# EAGLE design rgbMatrix (EAGLE 7.5.0)

## Sheet 1 of 4: CONTROLLER
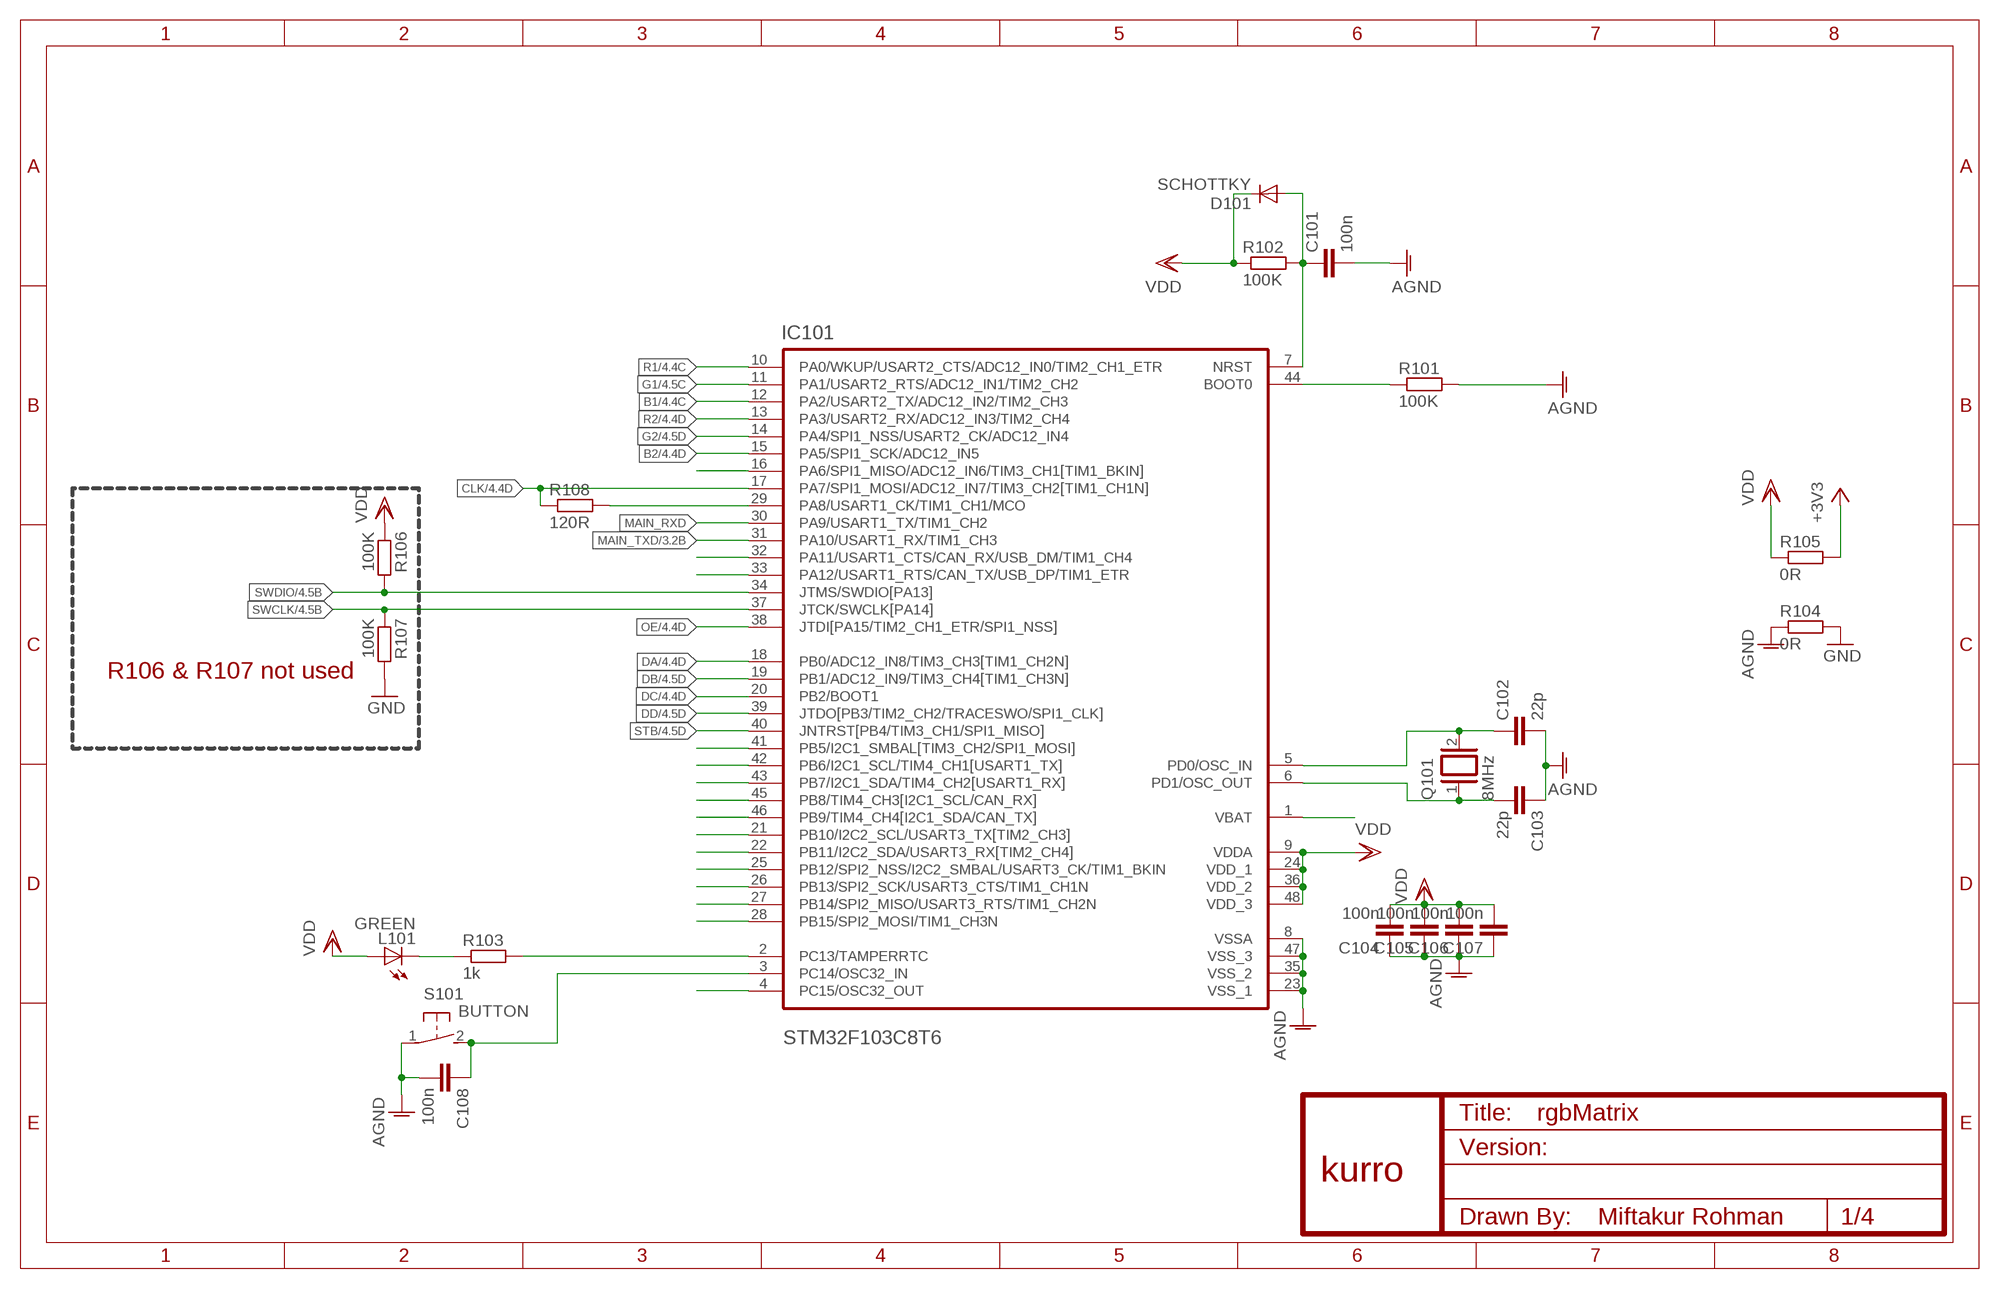
[diagram p0: schematic, sheet 1]

### Parts
C101  100n  C-EUC0603  [C0603]
C102  22p  C-EUC0603  [C0603]
C103  22p  C-EUC0603  [C0603]
C104  100n  C-EUC0603  [C0603]
C105  100n  C-EUC0603  [C0603]
C106  100n  C-EUC0603  [C0603]
C107  100n  C-EUC0603  [C0603]
C108  100n  C-EUC0603  [C0603]
D101  SCHOTTKY  DIODE-MICROMELF-W  [MICROMELF-W]
IC101  STM32F103C8T6  [QFP50P900X900X160-48N]
L101  GREEN  LED3MM  [LED3MM]
Q101  8MHz  XTAL/S  [QS]
R101  100K  R-EU_R0603  [R0603]
R102  100K  R-EU_R0603  [R0603]
R103  1k  R-EU_R0603  [R0603]
R104  0R  R-EU_R0603  [R0603]
R105  0R  R-EU_R0603  [R0603]
R106  100K  R-EU_R0603  [R0603]
R107  100K  R-EU_R0603  [R0603]
R108  120R  R-EU_R0603  [R0603]
S101  BUTTON  01-XX2  [B3F-01XXX]
U$1  KURRO_FOOTPRINT  [KURRO-LOGO]

### Nets
+3V3: R105.2 ; also sheet 2,3,4
AGND [ic]: C101.2 C102.2 C103.1 C104.1 C105.1 C106.1 C107.1 C108.2 IC101.8(VSSA) IC101.23(VSS_1) IC101.35(VSS_2) IC101.47(VSS_3) R101.2 R104.1 S101.1(P)
B1 [ic]: IC101.12(PA2/USART2_TX/ADC12_IN2/TIM2_CH3) ; also sheet 4
B2 [ic]: IC101.15(PA5/SPI1_SCK/ADC12_IN5) ; also sheet 4
BOOT0 [ic]: IC101.44(BOOT0) R101.1
CLK [ic]: IC101.17(PA7/SPI1_MOSI/ADC12_IN7/TIM3_CH2[TIM1_CH1N]) R108.1 ; also sheet 4
DA [ic]: IC101.18(PB0/ADC12_IN8/TIM3_CH3[TIM1_CH2N]) ; also sheet 4
DB [ic]: IC101.19(PB1/ADC12_IN9/TIM3_CH4[TIM1_CH3N]) ; also sheet 4
DC [ic]: IC101.20(PB2/BOOT1) ; also sheet 4
DD [ic]: IC101.39(JTDO[PB3/TIM2_CH2/TRACESWO/SPI1_CLK]) ; also sheet 4
G1 [ic]: IC101.11(PA1/USART2_RTS/ADC12_IN1/TIM2_CH2) ; also sheet 4
G2 [ic]: IC101.14(PA4/SPI1_NSS/USART2_CK/ADC12_IN4) ; also sheet 4
GND: R104.2 R107.2 ; also sheet 2,3,4
LED1_BUILTIN [ic]: IC101.2(PC13/TAMPERRTC) R103.2
MAIN_RXD [ic]: IC101.30(PA9/USART1_TX/TIM1_CH2)
MAIN_TXD [ic]: IC101.31(PA10/USART1_RX/TIM1_CH3) ; also sheet 3
N$1 [ic]: IC101.29(PA8/USART1_CK/TIM1_CH1/MCO) R108.2
N$2 [ic]: IC101.45(PB8/TIM4_CH3[I2C1_SCL/CAN_RX])
N$6 [ic]: C103.2 IC101.6(PD1/OSC_OUT) Q101.1
N$7 [ic]: C102.1 IC101.5(PD0/OSC_IN) Q101.2
N$8 [ic]: IC101.46(PB9/TIM4_CH4[I2C1_SDA/CAN_TX])
N$9 [ic]: L101.K(C) R103.1
N$11 [ic]: C108.1 IC101.3(PC14/OSC32_IN) S101.2(S)
N$13 [ic]: IC101.42(PB6/I2C1_SCL/TIM4_CH1[USART1_TX])
N$14 [ic]: IC101.43(PB7/I2C1_SDA/TIM4_CH2[USART1_RX])
N$15 [ic]: IC101.21(PB10/I2C2_SCL/USART3_TX[TIM2_CH3])
N$16 [ic]: IC101.22(PB11/I2C2_SDA/USART3_RX[TIM2_CH4])
N$24 [ic]: IC101.32(PA11/USART1_CTS/CAN_RX/USB_DM/TIM1_CH4)
N$27 [ic]: IC101.25(PB12/SPI2_NSS/I2C2_SMBAL/USART3_CK/TIM1_BKIN)
N$28 [ic]: IC101.26(PB13/SPI2_SCK/USART3_CTS/TIM1_CH1N)
N$29 [ic]: IC101.27(PB14/SPI2_MISO/USART3_RTS/TIM1_CH2N)
N$30 [ic]: IC101.28(PB15/SPI2_MOSI/TIM1_CH3N)
N$42 [ic]: IC101.16(PA6/SPI1_MISO/ADC12_IN6/TIM3_CH1[TIM1_BKIN])
N$46 [ic]: IC101.33(PA12/USART1_RTS/CAN_TX/USB_DP/TIM1_ETR)
N$51 [ic]: IC101.41(PB5/I2C1_SMBAL[TIM3_CH2/SPI1_MOSI])
N$57 [ic]: IC101.4(PC15/OSC32_OUT)
N$58 [ic]: IC101.1(VBAT)
OE [ic]: IC101.38(JTDI[PA15/TIM2_CH1_ETR/SPI1_NSS]) ; also sheet 4
R1 [ic]: IC101.10(PA0/WKUP/USART2_CTS/ADC12_IN0/TIM2_CH1_ETR) ; also sheet 4
R2 [ic]: IC101.13(PA3/USART2_RX/ADC12_IN3/TIM2_CH4) ; also sheet 4
RST [ic]: C101.1 D101.A IC101.7(NRST) R102.2
STB [ic]: IC101.40(JNTRST[PB4/TIM3_CH1/SPI1_MISO]) ; also sheet 4
SWCLK [ic]: IC101.37(JTCK/SWCLK[PA14]) R107.1 ; also sheet 4
SWDIO [ic]: IC101.34(JTMS/SWDIO[PA13]) R106.2 ; also sheet 4
VDD [ic]: C104.2 C105.2 C106.2 C107.2 D101.C IC101.9(VDDA) IC101.24(VDD_1) IC101.36(VDD_2) IC101.48(VDD_3) L101.A R102.1 R105.1 R106.1

### Notes on the sheet
- R106 & R107 not used

## Sheet 2 of 4: POWER
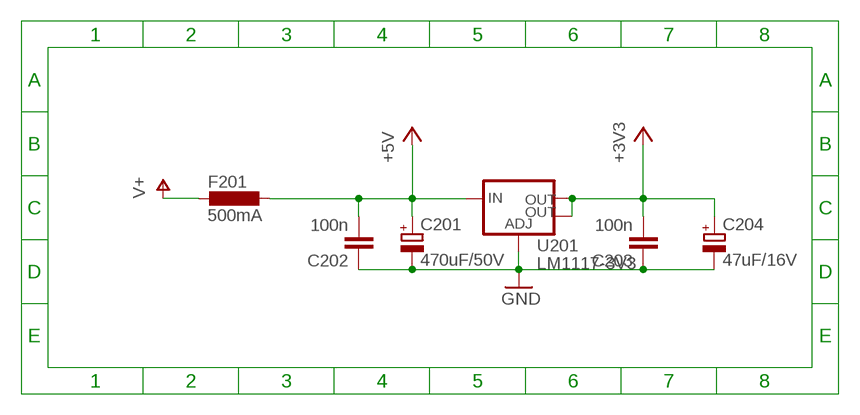
[diagram p1: schematic, sheet 2]

### Parts
C201  470uF/50V  CPOL-EUE5-10.5  [E5-10,5]
C202  100n  C-EUC0603  [C0603]
C203  100n  C-EUC0603  [C0603]
C204  47uF/16V  CPOL-EUE2-5  [E2-5]
F201  500mA  L-EUL1812  [L1812]
U201  LM1117-3V3  V_REG_LM1117SOT223  [SOT223]

### Nets
+3V3: C203.2 C204.+ U201.2(OUT) U201.4(OUT) ; also sheet 1,3,4
+5V: C201.+ C202.2 F201.1 U201.3(IN)
GND: C201.- C202.1 C203.1 C204.- U201.1(ADJ) ; also sheet 1,3,4
V+: F201.2 ; also sheet 4

## Sheet 3 of 4: COMM
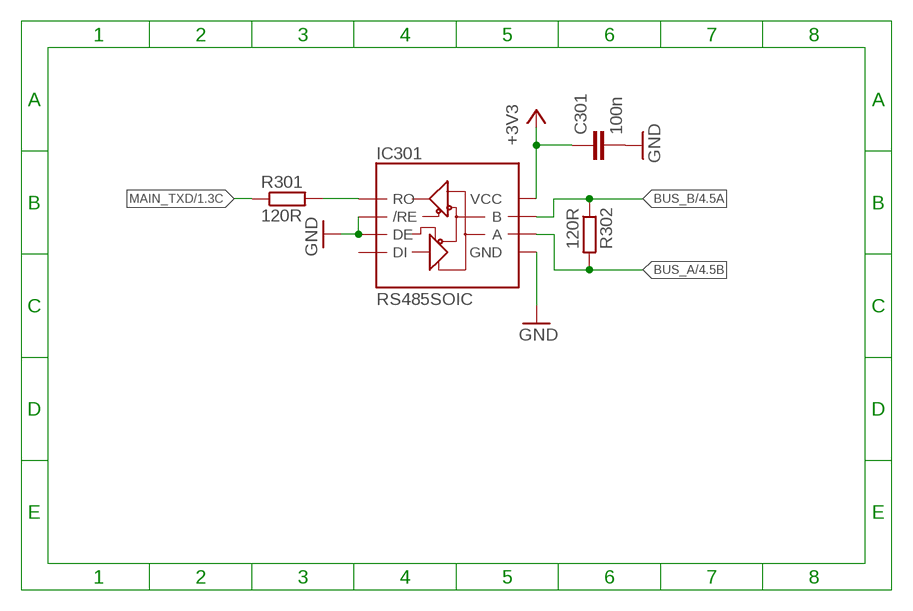
[diagram p2: schematic, sheet 3]

### Parts
C301  100n  C-EUC0603  [C0603]
IC301  RS485SOIC  [SO08]
R301  120R  R-EU_R0603  [R0603]
R302  120R  R-EU_R0603  [R0603]

### Nets
+3V3: C301.1 IC301.8(VCC) ; also sheet 1,2,4
BUS_A: IC301.6(A) R302.2 ; also sheet 4
BUS_B: IC301.7(B) R302.1 ; also sheet 4
GND: C301.2 IC301.2(/RE) IC301.3(DE) IC301.5(GND) ; also sheet 1,2,4
MAIN_TXD [ic]: R301.1 ; also sheet 1
N$10: IC301.1(RO) R301.2
Unconnected: IC301.4(DI)

## Sheet 4 of 4: CONNECTOR
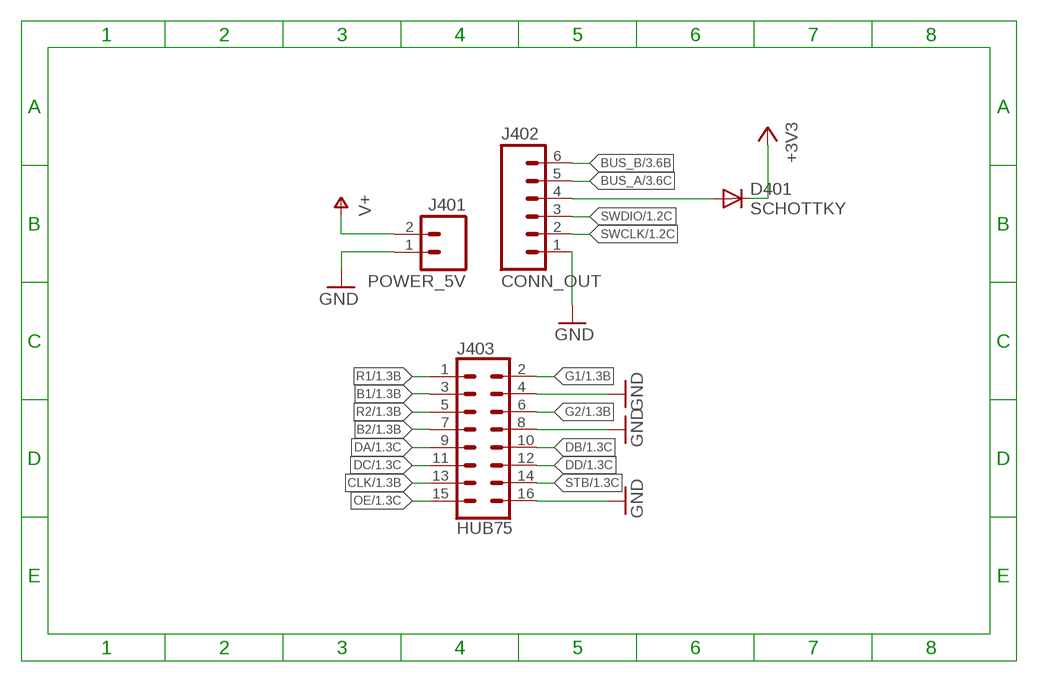
[diagram p3: schematic, sheet 4]

### Parts
D401  SCHOTTKY  DIODE-MICROMELF-W  [MICROMELF-W]
J401  POWER_5V  M02-XH-RA  [XH-2-RA]
J402  CONN_OUT  M06-XH-RA  [XH-6-RA]
J403  HUB75  PINHEAD-2X8  [2X08-LOCK]

### Nets
+3V3: D401.C ; also sheet 1,2,3
B1 [ic]: J403.3 ; also sheet 1
B2 [ic]: J403.7 ; also sheet 1
BUS_A: J402.5 ; also sheet 3
BUS_B: J402.6 ; also sheet 3
CLK [ic]: J403.13 ; also sheet 1
DA [ic]: J403.9 ; also sheet 1
DB [ic]: J403.10 ; also sheet 1
DC [ic]: J403.11 ; also sheet 1
DD [ic]: J403.12 ; also sheet 1
G1 [ic]: J403.2 ; also sheet 1
G2 [ic]: J403.6 ; also sheet 1
GND: J401.1 J402.1 J403.4 J403.8 J403.16 ; also sheet 1,2,3
N$3: D401.A J402.4
OE [ic]: J403.15 ; also sheet 1
R1 [ic]: J403.1 ; also sheet 1
R2 [ic]: J403.5 ; also sheet 1
STB [ic]: J403.14 ; also sheet 1
SWCLK [ic]: J402.2 ; also sheet 1
SWDIO [ic]: J402.3 ; also sheet 1
V+: J401.2 ; also sheet 2

## Library data of the parts
C101-C108 C202 C203 C301 = resistor:C-EU: CAPACITOR, European symbol
C201 C204 = rcl:CPOL-EU: POLARIZED CAPACITOR, European symbol
D101 D401 = diode:DIODE-: DIODE
F201 = rcl:L-EU: INDUCTOR, European symbol
IC101 = ST Microelctronics_By_element14_Batch_1:STM32F103C8T6: Medium-density performance line ARM-based 32-bit MCU; LINK: https://www.tokopedia.com/embedded-world/stm32-stm32f103c8t6-lqfp48-arm-based-microcontroller-mcu-lqfp-48-au02; MPN: STM32F103CBT6; OC_FARNELL: 1606327; OC_NEWARK: 11N8296; PACKAGE: QFP-48; SUPPLIER: STMICROELECTRONICS
IC301 = SparkFun-DigitalIC:RS485: RS485 transceiver
J401 = SparkFun-Connectors:M02: Standard 2-pin 0.1" header. Use with - straight break away headers ( PRT-00116) - right angle break away headers (PRT-00553) - swiss pins (PRT-00743) - machine pins (PRT-00117) - female headers (PRT-00115) Molex polarized connector foot print use with: PRT-08233 with associated crimp pins and housings. 2.54_SCREWTERM for use with PRT-10571. 3.5mm Screw Terminal footprints for PRT-08084 5mm Screw Terminal footprints for use with PRT-08433
J402 = SparkFun-Connectors:M06: Header 6 Standard 6-pin 0.1" header. Use with straight break away headers (SKU : PRT-00116), right angle break away headers (PRT-00553), swiss pins (PRT-00743), machine pins (PRT-00117), and female headers (PRT-00115). Molex polarized connector foot print use with SKU : PRT-08094 with associated crimp pins and housings. NOTES ON THE VARIANTS LOCK and LOCK_LONGPADS... This footprint was designed to help hold the alignment of a through-hole component (i.e. 6-pin header) while soldering it into place. You may notice that each hole has been shifted either up or down by 0.005 of an inch from it's more standard position (which is a perfectly straight line). This slight alteration caused the pins (the squares in the middle) to touch the edges of the holes. Because they are alternating, it causes a "brace" to hold the component in place. 0.005 has proven to be the perfect amount of "off-center" position when using our standard breakaway headers. Although looks a little odd when you look at the bare footprint, once you have a header in there, the alteration is very hard to notice. Also,if you push a header all the way into place, it is covered up entirely on the bottom side. This idea of altering the position of holes to aid alignment will be further integrated into the Sparkfun Library for other footprints. It can help hold any component with 3 or more connection pins.
J403 = edes_lib_160827:PINHEAD-2X8
L101 = SparkFun:LED: LEDs Standard schematic elements and footprints for 5mm, 3mm, 1206, and 0603 sized LEDs. 5mm - Spark Fun Electronics SKU : COM-00529 (and others)
Q101 = special:XTAL/S: CRYSTAL
R101-R103 R106-R108 R301 R302 = resistor:R-EU_: RESISTOR, European symbol
R104 R105 = resistor:R-EU_: RESISTOR, European symbol; LINK: https://www.tokopedia.com/iotelkafi/resistor-smd-0603-0r
S101 = switch-omron:01-XX
U201 = SparkFun-IC-Power:V_REG_LM1117: Voltage Regulator LM1117 Standard adjustable voltage regulator but in SMD form. Spark Fun Electronics SKU : COM-00595; PROD_ID: VREG-08170
U$1 = SparkFun:KURRO_FOOTPRINT

## Net classes
0 default: width 0.406 mm, drill 0.59 mm, clearance 0.305 mm
1 ic: width 0.254 mm, drill 0.59 mm, clearance 0.203 mm

## Board
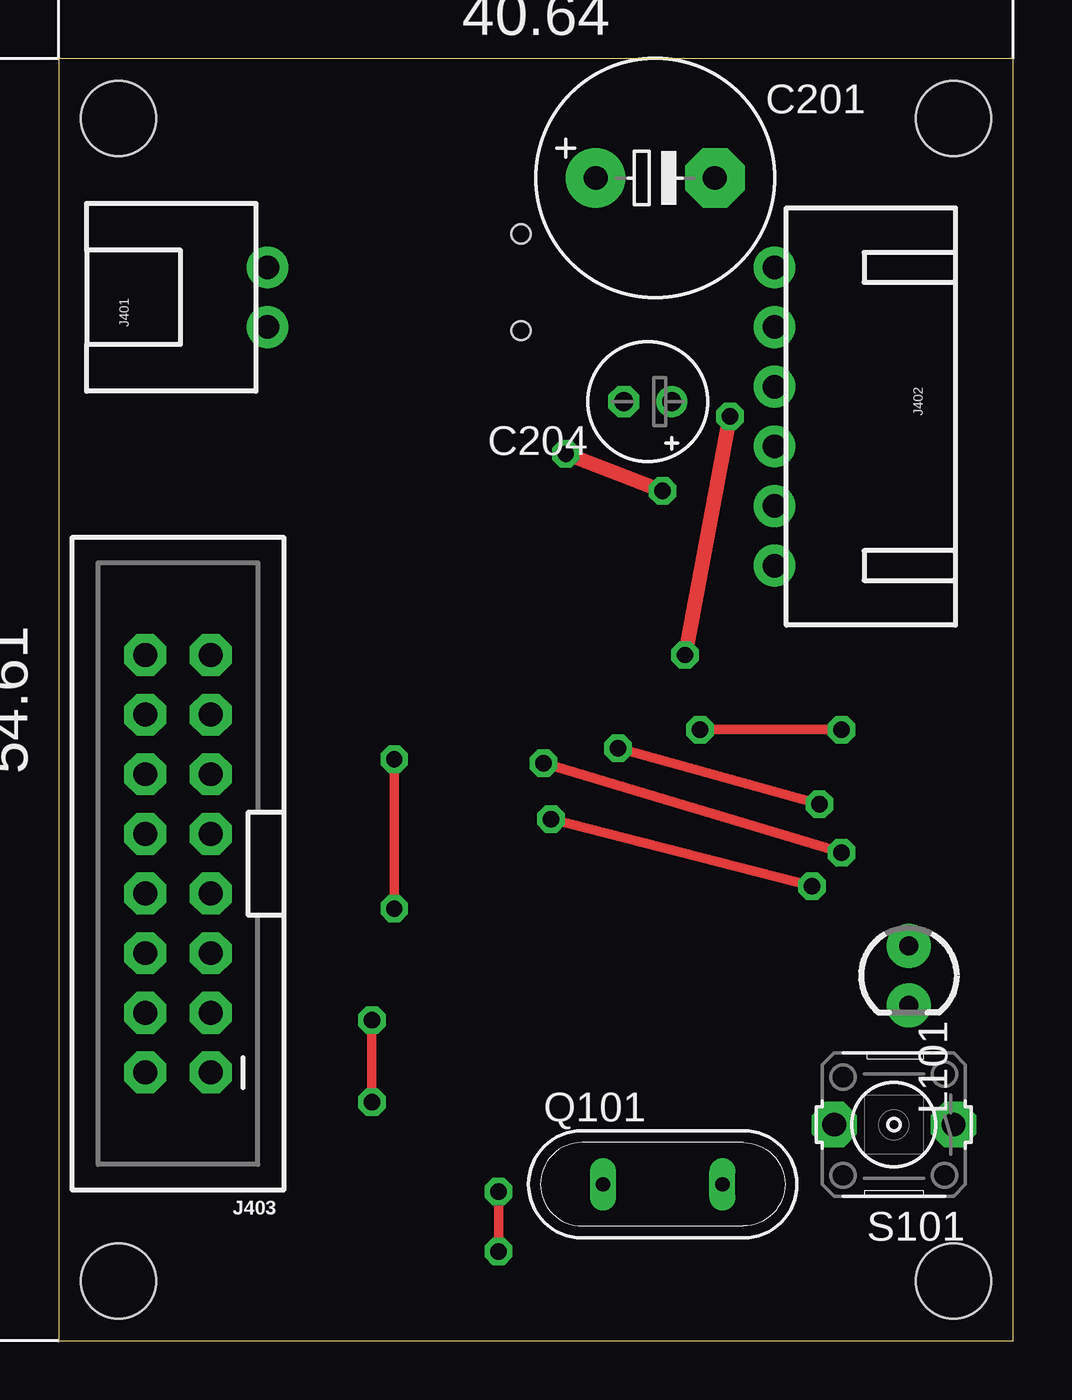
[diagram p4: board, top side]
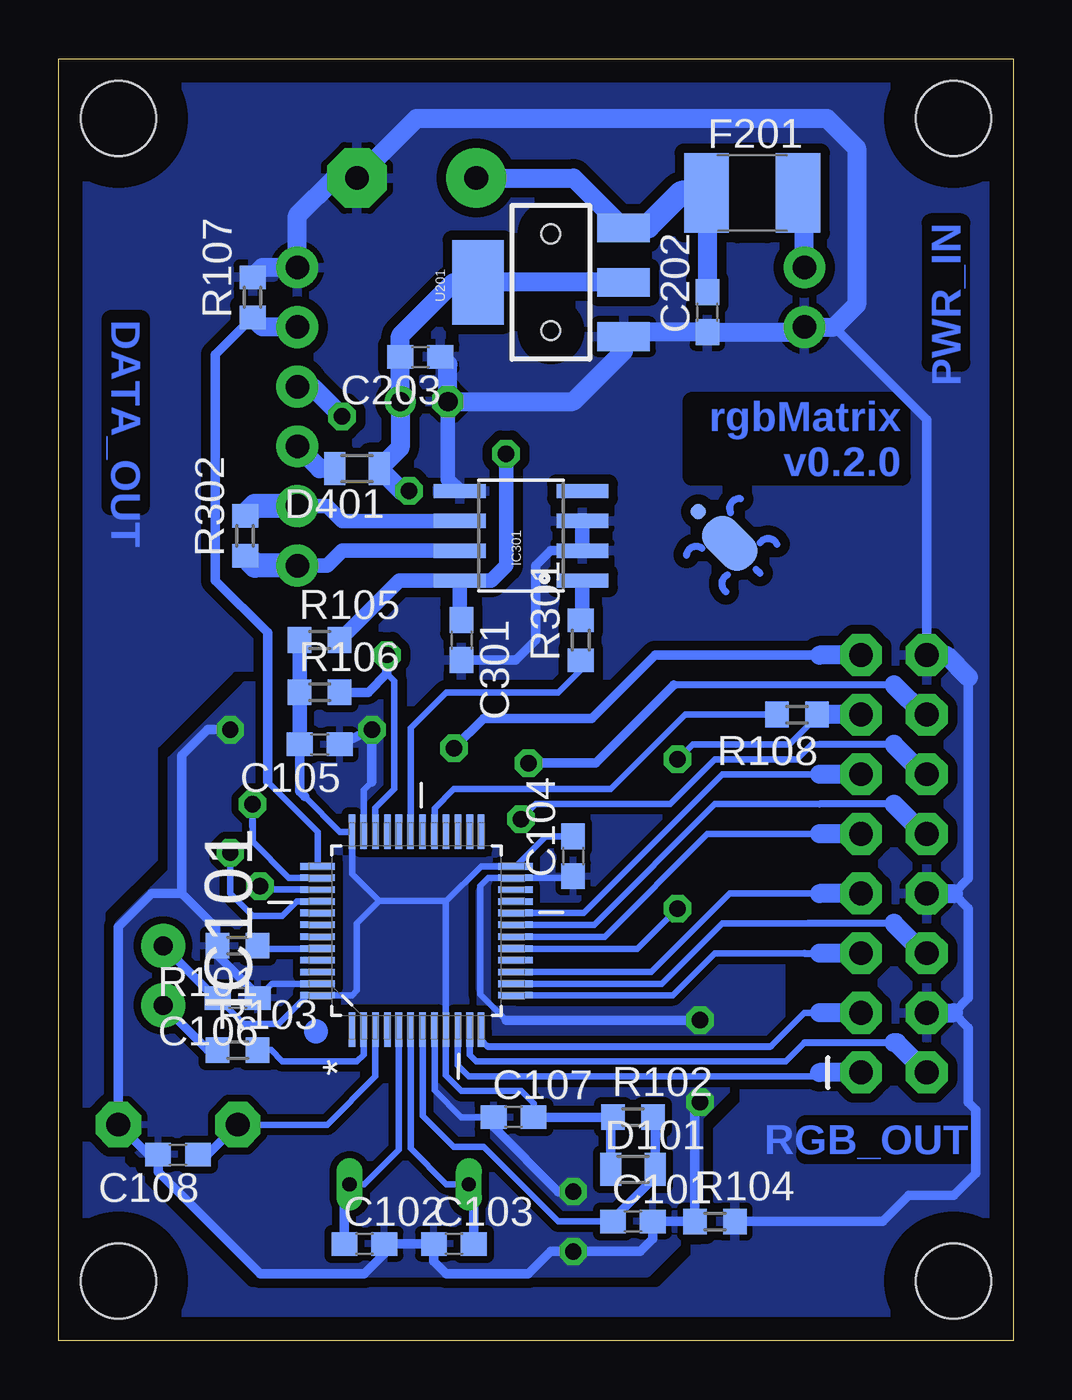
[diagram p5: board, bottom side, seen from below]

Size 40.64 x 54.61 mm. Coordinates in mm from the lower left corner, seen from the top.
Outline: 0,0 40.64,0 40.64,54.61 0,54.61 0,0
Copper layers (1*16): Top 0.035mm / dielectric 1.5mm / Bottom 0.035mm
Design rules "default *": minimum track width 10mil, minimum drill 24mil, track to track 8mil, track to pad 8mil, pad to pad 8mil, via to via 8mil, smd to smd 8mil, copper to edge 40mil, drill to drill 8mil, minimum pad ring 10mil, minimum via ring 8mil, stop-mask expansion 4mil, vias tented up to drill 0mil, thermal gap 10mil
Holes 3.2 mm at 2.54,2.54 38.1,2.54 38.1,52.07 2.54,52.07
Holes 0.8 mm at 19.68,43.02 19.68,47.15
bRestrict: area 0,0 to 5.1,5.1; area 35.6,0 to 40.6,5.1; area 35.6,49.5 to 40.6,54.6; area 0,49.5 to 5.1,54.6; area 10.5,47.1 to 11.7,50.6

### Footprints (pad centres in the part's own frame; a part is rotated, then mirrored left to right if it is on the bottom)
C0603 = smd 1.1 x 1: 1 -0.85,0; 2 0.85,0
E5-10,5 = drill 1.016 pad 2.54: + -2.54,0 | drill 1.016 pad 2.54 octagon: - 2.54,0
E2-5 = drill 0.813 pad 1.27: + -1.016,0 | drill 0.813 pad 1.27 octagon: - 1.016,0
MICROMELF-W = smd 0.9 x 1.4: A 0.95,0; C -0.95,0
L1812 = smd 1.9 x 3.4: 1 -1.95,0; 2 1.95,0
QFP50P900X900X160-48N = smd 1.473 x 0.279: 1 -4.216,2.743; 2 -4.216,2.261; 3 -4.216,1.753; 4 -4.216,1.245; 5 -4.216,0.762; 6 -4.216,0.254; 7 -4.216,-0.254; 8 -4.216,-0.762; 9 -4.216,-1.245; 10 -4.216,-1.753; 11 -4.216,-2.261; 12 -4.216,-2.743; 25 4.216,-2.743; 26 4.216,-2.261; 27 4.216,-1.753; 28 4.216,-1.245; 29 4.216,-0.762; 30 4.216,-0.254; 31 4.216,0.254; 32 4.216,0.762; 33 4.216,1.245; 34 4.216,1.753; 35 4.216,2.261; 36 4.216,2.743 | smd 0.279 x 1.473: 13 -2.743,-4.216; 14 -2.261,-4.216; 15 -1.753,-4.216; 16 -1.245,-4.216; 17 -0.762,-4.216; 18 -0.254,-4.216; 19 0.254,-4.216; 20 0.762,-4.216; 21 1.245,-4.216; 22 1.753,-4.216; 23 2.261,-4.216; 24 2.743,-4.216; 37 2.743,4.216; 38 2.261,4.216; 39 1.753,4.216; 40 1.245,4.216; 41 0.762,4.216; 42 0.254,4.216; 43 -0.254,4.216; 44 -0.762,4.216; 45 -1.245,4.216; 46 -1.753,4.216; 47 -2.261,4.216; 48 -2.743,4.216
SO08 = smd 0.61 x 2.21: 1 -1.905,-2.616; 2 -0.635,-2.616; 3 0.635,-2.616; 4 1.905,-2.616; 5 1.905,2.616; 6 0.635,2.616; 7 -0.635,2.616; 8 -1.905,2.616
XH-2-RA = drill 1 pad 1.778: 1 -1.27,0; 2 1.27,0
XH-6-RA = drill 1 pad 1.778: 1 -6.35,0; 2 -3.81,0; 3 -1.27,0; 4 1.27,0; 5 3.81,0; 6 6.35,0
2X08-LOCK = drill 1.016 pad 1.778 octagon: 1 -1.397,8.89; 2 1.397,8.89; 3 -1.397,6.35; 4 1.397,6.35; 5 -1.397,3.81; 6 1.397,3.81; 7 -1.397,1.27; 8 1.397,1.27; 9 -1.397,-1.27; 10 1.397,-1.27; 11 -1.397,-3.81; 12 1.397,-3.81; 13 -1.397,-6.35; 14 1.397,-6.35; 15 -1.397,-8.89; 16 1.397,-8.89
LED3MM = drill 0.813 pad 1.88: A -1.27,0; K 1.27,0
QS = drill 0.61 long: 1 -2.54,0; 2 2.54,0
R0603 = smd 1 x 1.1: 1 -0.85,0; 2 0.85,0
B3F-01XXX = drill 1.016 pad 1.93 octagon: 1 -2.54,0; 2 2.54,0
SOT223 = smd 1.219 x 2.235: 1 -2.311,-3.099; 2 0,-3.099; 3 2.311,-3.099 | smd 3.6 x 2.2: 4 0,3.099
KURRO-LOGO = smd 2.54 x 1.651 rotated 45 bottom: P$1 0,0 | smd 0.635 x 0.635 rotated 45 bottom: P$2 1.347,1.347

### Placement (x,y rotation side)
C101  16.19,5.08 0 bottom
C102  27.62,4.13 0 bottom
C103  23.81,4.13 0 bottom
C104  18.73,20.64 90 bottom
C105  29.53,25.4 180 bottom
C106  33.02,14.61 180 bottom
C107  21.27,9.53 0 bottom
C108  35.56,7.94 180 bottom
C201  25.4,49.53 0 top
C202  13.02,43.81 90 bottom
C203  25.24,41.91 180 bottom
C204  25.08,40.01 180 top
C301  23.5,29.84 270 bottom
D101  16.19,7.3 0 bottom
D401  27.94,37.15 180 bottom
F201  11.11,48.9 0 bottom
IC101  25.4,17.46 90 bottom
IC301  20.95,34.29 90 bottom
J401  8.89,44.45 90 top
J402  30.48,39.37 270 top
J403  5.08,20.32 180 top
L101  36.2,15.56 270 top
Q101  25.72,6.67 0 top
R101  33.02,16.83 180 bottom
R102  16.19,9.53 0 bottom
R103  33.02,12.38 0 bottom
R104  12.7,5.08 0 bottom
R105  29.53,29.84 0 bottom
R106  29.53,27.62 0 bottom
R107  32.38,44.45 90 bottom
R108  9.21,26.67 180 bottom
R301  18.41,29.84 90 bottom
R302  32.7,34.29 90 bottom
S101  35.56,9.21 180 top
U201  19.68,45.09 90 bottom
U$1  12.06,33.97 0 top

### Tracks (layer width: path | path; a pad name or v marks a point on that pad's centre or on a via)
+3V3  (via drill 0.7 pad 1.17)
  Top 0.61: v25.72,36.2 v21.59,37.78
  Bottom 0.61: IC301.8 23.57,30.77 C301.1 | v21.59,37.78 21.59,33.02 22.23,32.38 IC301.8 | IC301.8 26.14,32.38 R105.2
  Bottom 0.813: U201.2 U201.4 23.81,45.09 26.09,42.81 C203.2 C204.+ 26.1,38.04 D401.C 26.04,36.2 v25.72,36.2
+5V
  Bottom 0.813: F201.1 13.02,48.85 C202.2 | C201.+ 18.72,49.53 U201.3
  Bottom 1.016: F201.1 14.13,48.9 15.56,47.47 16.52,47.47 U201.3
AGND  (via drill 0.7 pad 1.17)
  Top 0.406: v18.73,6.35 v18.73,3.81 | v13.34,10.16 v13.34,13.65 | v27.3,26.04 v33.34,26.04
  Bottom 0.279: IC101.47 31.57,15.2 C106.1 | C104.1 18.8,19.72 IC101.23 22.35,19.72 22.7,19.37 22.7,14.76 21.59,13.65 | IC101.35 27.66,23.46 27.3,23.81 | IC101.8 24.64,10.67 23.5,9.53 C107.1
  Bottom 0.406: C106.1 32.17,14.71 33.87,16.41 R101.2 33.97,16.93 33.97,17.62 35.4,19.05 | C107.1 22.12,9.11 19.37,6.35 v18.73,6.35 | v13.34,13.65 21.59,13.65 | v13.34,10.16 13.55,9.95 R104.1 C101.2 15.34,4.34 15.88,3.81 v18.73,3.81 19.68,3.81 20.64,2.86 24.13,2.86 24.66,3.39 C103.1 C102.2 26.77,3.71 27.62,2.86 32.07,2.86 36.41,7.2 C108.2 36.83,7.94 S101.1 38.1,17.62 36.67,19.05 35.4,19.05 | 27.3,23.81 v27.3,26.04 C105.1 | v33.34,26.04 34.29,26.04 35.4,24.92 35.4,19.05
  Bottom 0.61: 28.57,25.3 C105.1
  pour Bottom (isolate 0.305, rank 5): 9.84,13.02 9.84,21.59 26.04,27.94 32.7,27.94 35.88,24.77 35.88,20 38.1,17.78 38.1,8.89 32.07,2.86 15.56,2.86 13.34,5.08 13.34,9.53
B1
  Bottom 0.279: IC101.12 22.66,12.81 22.38,12.54 | 10.32,12.54 8.89,13.97 8.26,13.97
  Bottom 0.305: 22.38,12.54 10.32,12.54
  Bottom 0.813: J403.3 8.26,13.97
B2
  Bottom 0.279: IC101.15 15.4,15.71 12.06,19.05 8.26,19.05
  Bottom 0.813: J403.7 8.26,19.05
BOOT0
  Bottom 0.279: IC101.44 32.04,16.7 R101.1
BUS_A
  Bottom 0.61: IC301.6 28.57,34.92 29.21,35.56 J402.5
  Bottom 1.016: J402.5 32.28,35.56 R302.2
BUS_B
  Bottom 0.61: IC301.7 28.57,33.66 29.21,33.02 J402.6
  Bottom 1.016: J402.6 32.28,33.02 R302.1
CLK  (via drill 0.7 pad 1.17)
  Top 0.406: v14.29,18.41 v14.29,24.77
  Bottom 0.279: IC101.17 16,16.7 v14.29,18.41 | R108.1 8.36,26.57 9.53,25.4 13.65,25.4 v14.29,24.77
  Bottom 0.813: J403.13 R108.1
DA
  Bottom 0.279: IC101.18 17.4,17.21 13.02,21.59 8.26,21.59
  Bottom 0.813: J403.9 8.26,21.59
DB
  Bottom 0.279: IC101.19 17.84,17.72 12.7,22.86 8.26,22.86
  Bottom 0.305: 5.08,22.86 8.26,22.86
  Bottom 0.813: J403.10 3.81,21.59 5.08,22.86
DC
  Bottom 0.279: IC101.20 18.29,18.22 12.38,24.13 8.26,24.13
  Bottom 0.813: J403.11 8.26,24.13
DD  (via drill 0.7 pad 1.17)
  Top 0.406: v20.95,22.23 v32.07,19.37
  Bottom 0.279: 8.26,25.4 8.57,25.4 9.21,24.77 12.7,24.77 14.61,22.86 20.32,22.86 v20.95,22.23 | IC101.39 31.91,19.21 v32.07,19.37
  Bottom 0.305: 5.08,25.4 8.26,25.4
  Bottom 0.813: J403.12 3.81,24.13 5.08,25.4
G1
  Bottom 0.279: IC101.11 23.14,12.19 22.86,11.91 9.68,11.91 8.89,12.7
  Bottom 0.305: 5.08,12.7 8.89,12.7
  Bottom 0.813: 5.08,12.7 4.95,12.7 J403.2
G2
  Bottom 0.279: IC101.14 14.96,15.2 12.38,17.78 8.73,17.78
  Bottom 0.305: 5.08,17.78 8.73,17.78
  Bottom 0.813: J403.6 3.81,16.51 5.08,17.78
GND
  Bottom 0.406: C301.2 21.17,29 20.32,29.84 20.32,33.02 19.68,33.66 IC301.2 | 1.91,28.26 1.91,19.68 2.54,19.05 1.91,18.41 1.91,14.61 2.54,13.97 1.91,13.34 1.91,10.16 1.59,9.84 1.59,7.14 2.54,6.19 4.45,6.19 5.56,5.08 R104.2 | J403.16 3.68,39.24 7.62,43.18
  Bottom 0.61: C204.- 24.07,36.69 IC301.5 | IC301.3 IC301.2
  Bottom 0.813: J403.4 2.54,13.97 | J403.8 2.54,19.05 | J403.16 2.86,29.21 1.91,28.26 | C203.1 24.07,41.59 C204.- 18.73,40.01 16.59,42.15 U201.1 16.39,42.97 C202.1 9.11,42.97 J401.1 7.62,43.18 6.67,44.13 6.67,50.8 7.94,52.07 25.4,52.07 C201.- 28.89,49.53 30.48,47.94 J402.1 31.96,45.72 R107.2
  pour Bottom (isolate 0.406, rank 6): 0,0 40.64,0 40.64,54.61 0,54.61
LED1_BUILTIN
  Bottom 0.279: IC101.2 27.66,12.19 27.94,11.91 31.11,11.91 31.59,12.38 R103.2
MAIN_TXD
  Bottom 0.279: 18.52,28.89 R301.1 18.41,28.57 19.37,27.62 24.13,27.62 25.65,26.1 IC101.31
  Bottom 0.406: R301.1 18.41,28.89
N$1
  Bottom 0.279: R108.2 13.97,26.67 17.14,23.5 23.81,23.5 24.64,22.67 IC101.29
N$3
  Bottom 0.813: D401.A 29.53,37.15 J402.4
N$6
  Bottom 0.279: IC101.6 25.65,8.19 24.13,6.67 Q101.1
  Bottom 0.406: C103.2 22.96,6.45 Q101.1
N$7
  Bottom 0.279: IC101.5 26.16,8.13 27.62,6.67 Q101.2
  Bottom 0.406: C102.1 28.47,6.45 Q101.2
N$9
  Bottom 0.406: L101.K 34.29,12.38 R103.1
  Bottom 0.61: 33.97,12.28 R103.1
N$10
  Bottom 0.61: IC301.1 18.34,30.77 R301.2
N$11
  Bottom 0.279: IC101.3 27.15,11.27 29.21,9.21 S101.2
  Bottom 0.406: C108.1 34.29,7.94 S101.2
OE  (via drill 0.7 pad 1.17)
  Top 0.406: v23.81,25.24 v32.38,22.86
  Bottom 0.279: IC101.38 30.84,19.72 32.38,21.27 32.38,21.91
  Bottom 0.305: 32.38,21.91 v32.38,22.86
  Bottom 0.406: 8.26,29.21 15.24,29.21 17.94,26.51 22.54,26.51 v23.81,25.24
  Bottom 0.813: J403.15 8.26,29.21
R1
  Bottom 0.279: IC101.10 23.65,11.74 23.18,11.27 8.41,11.27 8.26,11.43
  Bottom 0.813: J403.1 8.26,11.43
R2
  Bottom 0.279: IC101.13 14.49,14.72 12.7,16.51 8.89,16.51
  Bottom 0.305: 8.89,16.51 8.26,16.51
  Bottom 0.813: J403.5 8.26,16.51
RST
  Bottom 0.279: IC101.7 25.15,9.59 23.81,8.26 22.54,8.26 19.37,5.08 C101.1 17.14,5.08
  Bottom 0.406: C101.1 17.04,5.18 15.24,6.98 D101.A 15.24,9.43 R102.2
STB  (via drill 0.7 pad 1.17)
  Top 0.406: v20.64,24.61 v33.34,20.8
  Bottom 0.279: IC101.40 30.5,18.71 31.11,18.1 32.38,18.1 33.34,19.05 v33.34,20.8
  Bottom 0.305: 5.08,27.94 14.45,27.94
  Bottom 0.406: v20.64,24.61 17.78,24.61 14.45,27.94
  Bottom 0.813: J403.14 3.81,26.67 5.08,27.94
SWCLK
  Bottom 0.279: IC101.37 29.62,21.68 31.75,23.81
  Bottom 0.406: 31.75,23.81 31.75,30.16 33.97,32.38 33.97,42.01 R107.1
  Bottom 0.813: J402.2 31.96,43.18 R107.1
SWDIO  (via drill 0.7 pad 1.17)
  Top 0.61: v28.57,39.37 v26.67,29.21
  Bottom 0.279: IC101.34 27.15,22.7 26.35,23.5 26.35,28.1 26.67,28.42
  Bottom 0.406: R106.2 27.46,27.62 26.67,28.42 v26.67,29.21
  Bottom 0.813: J402.3 29.84,40.64 v28.57,39.37
V+
  Bottom 0.813: J401.2 8.89,48.62 F201.2
VDD
  Bottom 0.279: 24.16,18.71 IC101.9 24.16,11.3 23.5,10.64 20.95,10.64 20.42,10.1 C107.2 | 24.16,18.71 22.66,20.21 IC101.24 19.9,21.49 C104.2 | 26.99,18.73 27.94,17.78 27.94,14.92 28.14,14.72 IC101.48 30.05,14.72 31.27,13.49 32.76,13.49 C106.2 | 26.99,18.73 24.18,18.73 24.16,18.71 | 26.99,18.73 28.14,19.89 IC101.36 28.66,21.68 30.16,23.18
  Bottom 0.406: D101.C 17.14,9.43 R102.1 C107.2 20.64,9.74 | C105.2 30.38,23.39 30.16,23.18 | L101.A 33.97,14.61 C106.2
  Bottom 0.61: R105.1 R106.1 C105.2
  pour Bottom (isolate 0.356): 21.91,13.97 28.89,13.97 28.89,20.95 21.91,20.95
(copper drawn outside any net)
  shapes: Bottom circle x1

### Text on the board
Bottom: PWR_IN | DATA_OUT | rgbMatrix / v0.2.0 | RGB_OUT